# Altium schematic sheet fullCURRENT power logic.SchDoc: fullCURRENT 1.0
size C; Author: JNutzmann; CompanyName: FSE; DocumentNumber: 2
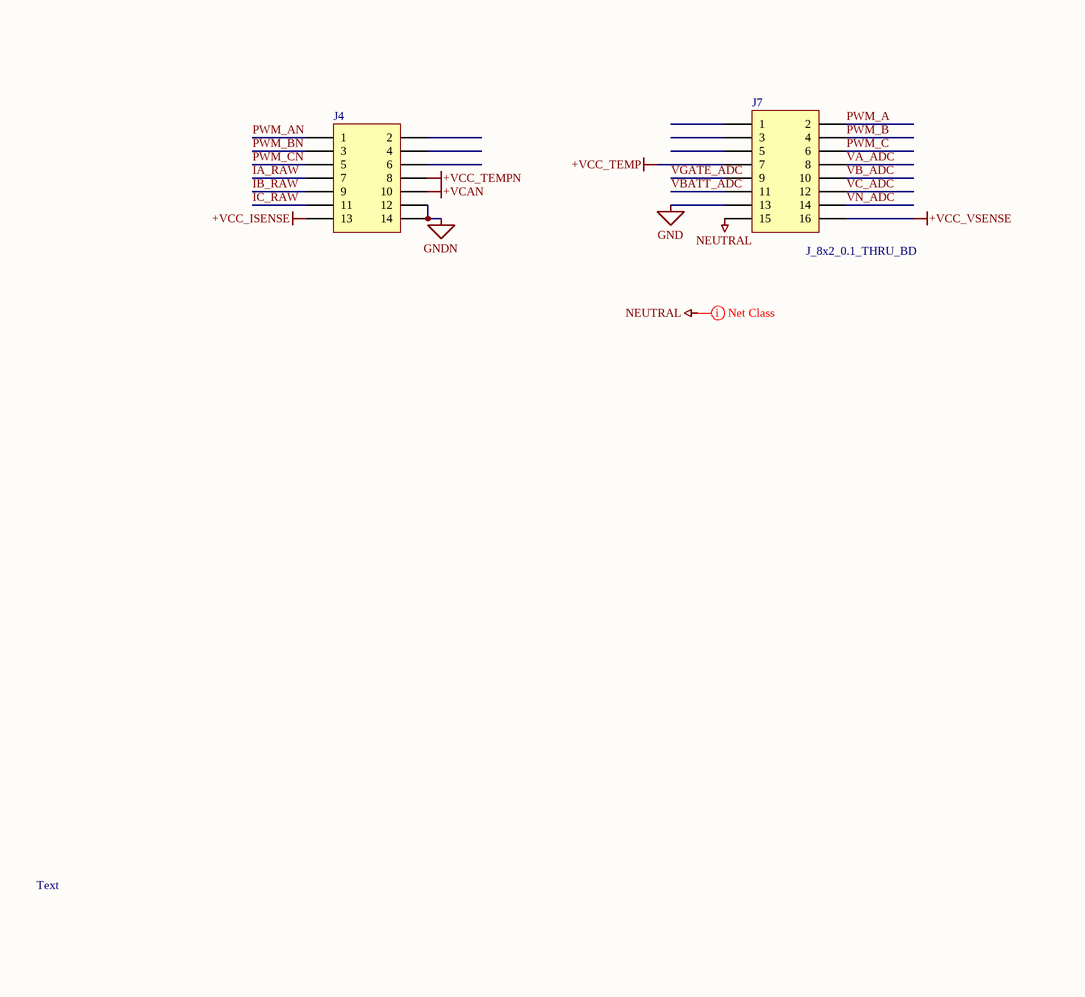
[diagram p0: fullCURRENT power logic.SchDoc, left]
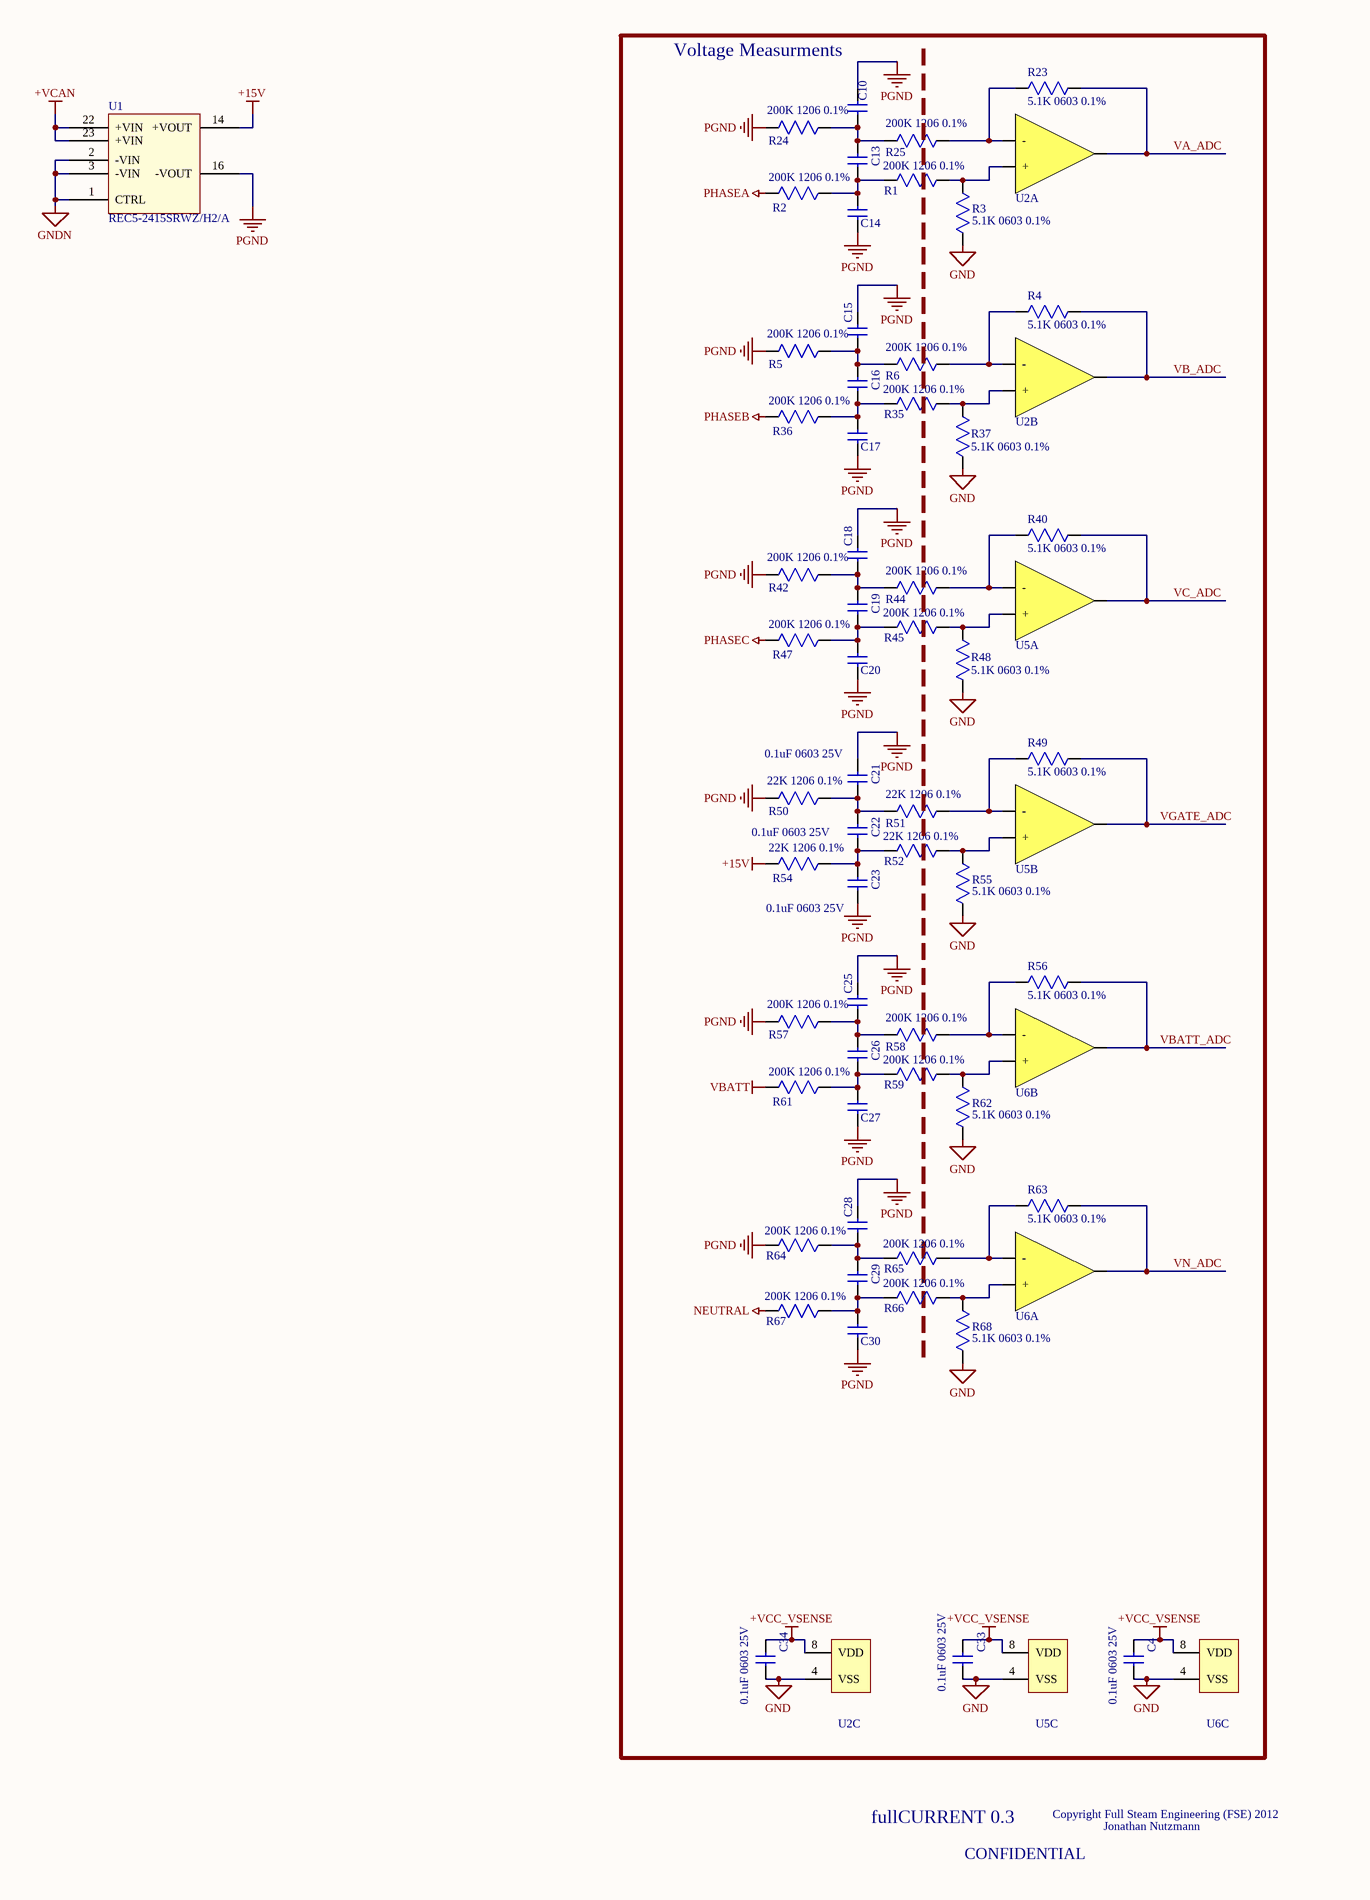
[diagram p1: fullCURRENT power logic.SchDoc, right]

## Parts
C4  value 0.1uF 0603 25V  [0603_cap]  (hidden comment: CAP 0603)
C10  CAP 0603  [0603_cap]  (value not drawn)
C13  CAP 0603  [0603_cap]  (value not drawn)
C14  CAP 0603  [0603_cap]  (value not drawn)
C15  CAP 0603  [0603_cap]  (value not drawn)
C16  CAP 0603  [0603_cap]  (value not drawn)
C17  CAP 0603  [0603_cap]  (value not drawn)
C18  CAP 0603  [0603_cap]  (value not drawn)
C19  CAP 0603  [0603_cap]  (value not drawn)
C20  CAP 0603  [0603_cap]  (value not drawn)
C21  value 0.1uF 0603 25V  [0603_cap]  (hidden comment: CAP 0603)
C22  value 0.1uF 0603 25V  [0603_cap]  (hidden comment: CAP 0603)
C23  value 0.1uF 0603 25V  [0603_cap]  (hidden comment: CAP 0603)
C25  CAP 0603  [0603_cap]  (value not drawn)
C26  CAP 0603  [0603_cap]  (value not drawn)
C27  CAP 0603  [0603_cap]  (value not drawn)
C28  CAP 0603  [0603_cap]  (value not drawn)
C29  CAP 0603  [0603_cap]  (value not drawn)
C30  CAP 0603  [0603_cap]  (value not drawn)
C33  value 0.1uF 0603 25V  [0603_cap]  (hidden comment: CAP 0603)
C34  value 0.1uF 0603 25V  [0603_cap]  (hidden comment: CAP 0603)
J4  J_7x2_0.1_THRU_BD  [ZW-07-10-X-D-500-085]  (value not drawn)
J7  J_8x2_0.1_THRU_BD  [ZW-08-10-X-D-500-085]
R1  value 200K 1206 0.1%  [1206_Resistor]  (hidden comment: RES 1206)
R2  value 200K 1206 0.1%  [1206_Resistor]  (hidden comment: RES 1206)
R3  value 5.1K 0603 0.1%  [0603_res]  (hidden comment: RES 0603)
R4  value 5.1K 0603 0.1%  [0603_res]  (hidden comment: RES 0603)
R5  value 200K 1206 0.1%  [1206_Resistor]  (hidden comment: RES 1206)
R6  value 200K 1206 0.1%  [1206_Resistor]  (hidden comment: RES 1206)
R23  value 5.1K 0603 0.1%  [0603_res]  (hidden comment: RES 0603)
R24  value 200K 1206 0.1%  [1206_Resistor]  (hidden comment: RES 1206)
R25  value 200K 1206 0.1%  [1206_Resistor]  (hidden comment: RES 1206)
R35  value 200K 1206 0.1%  [1206_Resistor]  (hidden comment: RES 1206)
R36  value 200K 1206 0.1%  [1206_Resistor]  (hidden comment: RES 1206)
R37  value 5.1K 0603 0.1%  [0603_res]  (hidden comment: RES 0603)
R40  value 5.1K 0603 0.1%  [0603_res]  (hidden comment: RES 0603)
R42  value 200K 1206 0.1%  [1206_Resistor]  (hidden comment: RES 1206)
R44  value 200K 1206 0.1%  [1206_Resistor]  (hidden comment: RES 1206)
R45  value 200K 1206 0.1%  [1206_Resistor]  (hidden comment: RES 1206)
R47  value 200K 1206 0.1%  [1206_Resistor]  (hidden comment: RES 1206)
R48  value 5.1K 0603 0.1%  [0603_res]  (hidden comment: RES 0603)
R49  value 5.1K 0603 0.1%  [0603_res]  (hidden comment: RES 0603)
R50  value 22K 1206 0.1%  [1206_Resistor]  (hidden comment: RES 1206)
R51  value 22K 1206 0.1%  [1206_Resistor]  (hidden comment: RES 1206)
R52  value 22K 1206 0.1%  [1206_Resistor]  (hidden comment: RES 1206)
R54  value 22K 1206 0.1%  [1206_Resistor]  (hidden comment: RES 1206)
R55  value 5.1K 0603 0.1%  [0603_res]  (hidden comment: RES 0603)
R56  value 5.1K 0603 0.1%  [0603_res]  (hidden comment: RES 0603)
R57  value 200K 1206 0.1%  [1206_Resistor]  (hidden comment: RES 1206)
R58  value 200K 1206 0.1%  [1206_Resistor]  (hidden comment: RES 1206)
R59  value 200K 1206 0.1%  [1206_Resistor]  (hidden comment: RES 1206)
R61  value 200K 1206 0.1%  [1206_Resistor]  (hidden comment: RES 1206)
R62  value 5.1K 0603 0.1%  [0603_res]  (hidden comment: RES 0603)
R63  value 5.1K 0603 0.1%  [0603_res]  (hidden comment: RES 0603)
R64  value 200K 1206 0.1%  [1206_Resistor]  (hidden comment: RES 1206)
R65  value 200K 1206 0.1%  [1206_Resistor]  (hidden comment: RES 1206)
R66  value 200K 1206 0.1%  [1206_Resistor]  (hidden comment: RES 1206)
R67  value 200K 1206 0.1%  [1206_Resistor]  (hidden comment: RES 1206)
R68  value 5.1K 0603 0.1%  [0603_res]  (hidden comment: RES 0603)
U1  U_REC5-2415SRWZ/H2/A  [REC5-2415SRWZ/H2/A]  (value not drawn)
U2  IC OP AMP  [SOIC127P600X175-8N]  (value not drawn)  (parts A,B,C of 3)
U5  IC OP AMP  [SOIC127P600X175-8N]  (value not drawn)  (parts A,B,C of 3)
U6  IC OP AMP  [SOIC127P600X175-8N]  (value not drawn)  (parts A,B,C of 3)

## Blocks framed on the sheet
Voltage Measurments: C4 C10 C13-C23 C25-C30 C33 C34 R1-R6 R23-R25 R35-R37 R40 R42 R44 R45 R47-R52 R54-R59 R61-R68 U2 U5 U6

## Nets
+15V: R54.2 U1.14(+VOUT)
+VCAN: J4.10 U1.22(+VIN) U1.23(+VIN)
+VCC_ISENSE: J4.13
+VCC_TEMP: J7.7
+VCC_TEMPN: J4.8
+VCC_VSENSE: C4.2 C33.2 C34.2 J7.16 U2.8(VDD) U5.8(VDD) U6.8(VDD)
GND: C4.1 C33.1 C34.1 J7.13 R3.1 R37.2 R48.1 R55.1 R62.1 R68.1 U2.4(VSS) U5.4(VSS) U6.4(VSS)
GNDN: J4.12 J4.14 U1.1(CTRL) U1.2(-VIN) U1.3(-VIN)
NEUTRAL: J7.15 R67.2
PGND: C10.2 C14.1 C15.2 C17.1 C18.2 C20.1 C21.2 C23.1 C25.2 C27.1 C28.2 C30.1 R5.2 R24.2 R42.2 R50.2 R57.2 R64.2 U1.16(-VOUT)
PHASEA: R2.2
PHASEB: R36.2
PHASEC: R47.2
VBATT: R61.2
IA_RAW: J4.7
IB_RAW: J4.9
IC_RAW: J4.11
PWM_A: J7.2
PWM_AN: J4.1
PWM_B: J7.4
PWM_BN: J4.3
PWM_C: J7.6
PWM_CN: J4.5
VA_ADC: J7.8 R23.2 U2.1(Vo)
VB_ADC: J7.10 R4.2 U2.7(Vo)
VBATT_ADC: J7.11 R56.1 U6.7(Vo)
VC_ADC: J7.12 R40.1 U5.1(Vo)
VGATE_ADC: J7.9 R49.1 U5.7(Vo)
VN_ADC: J7.14 R63.1 U6.1(Vo)
NetC10_1: C10.1 C13.2 R24.1 R25.2
NetC13_1: C13.1 C14.2 R1.2 R2.1
NetC15_1: C15.1 C16.2 R5.1 R6.2
NetC16_1: C16.1 C17.2 R35.2 R36.1
NetC18_1: C18.1 C19.2 R42.1 R44.2
NetC19_1: C19.1 C20.2 R45.2 R47.1
NetC21_1: C21.1 C22.2 R50.1 R51.2
NetC22_1: C22.1 C23.2 R52.2 R54.1
NetC25_1: C25.1 C26.2 R57.1 R58.2
NetC26_1: C26.1 C27.2 R59.2 R61.1
NetC28_1: C28.1 C29.2 R64.1 R65.2
NetC29_1: C29.1 C30.2 R66.2 R67.1
NetR1_1: R1.1 R3.2 U2.3(+)
NetR4_1: R4.1 R6.1 U2.6(-)
NetR23_1: R23.1 R25.1 U2.2(-)
NetR35_1: R35.1 R37.1 U2.5(+)
NetR40_2: R40.2 R44.1 U5.2(-)
NetR45_1: R45.1 R48.2 U5.3(+)
NetR49_2: R49.2 R51.1 U5.6(-)
NetR52_1: R52.1 R55.2 U5.5(+)
NetR56_2: R56.2 R58.1 U6.6(-)
NetR59_1: R59.1 R62.2 U6.5(+)
NetR63_2: R63.2 R65.1 U6.2(-)
NetR66_1: R66.1 R68.2 U6.3(+)

Not connected (* = marked no-connect by the designer): J4 2 4 6; J7 1 3 5

## Layout directives
net class HV: NEUTRAL

## Notes on the sheet
- Text
- fullCURRENT 0.3
- Copyright Full Steam Engineering (FSE) 2012
- Jonathan Nutzmann
- CONFIDENTIAL
- Labels drawn without touching a wire or pin: NEUTRAL

## Library data of the parts
C4 C21-C23 C33 C34 = C_0603: CAP CERM 0.1uF 0603 X7R; Supplier 1: Digi-Key; Supplier Part Number 1: 490-1524-1-ND
C10 C13-C20 C25-C30 = C_0603: CAP CERM 47PF 100V 0603 NP0; Supplier 1: Digi-Key; Supplier Part Number 1: 399-7917-1-ND
J4 = J_7x2_0.1_THRU_BD: 7 x 2 0.1" Header; Manufacturer Part Number: ZW-07-19-F-D-1000-085; Manufacturer: Samtec; Supplier 1: Samtec; Supplier Part Number 1: ZW-07-19-F-D-1000-085
J7 = J_8x2_0.1_THRU_BD: 8 x 2 0.1" Header; Manufacturer: Samtec; Manufacturer Part Number: ZW-08-10-X-D-500-085; Supplier 1: Samtec; Supplier Part Number 1: ZW-08-10-X-D-500-085
R1 R2 R5 R6 R24 R25 R35 R36 R42 R44 R45 R47 R57-R59 R61 R64-R67 = R_1206: RES 200K 1206 0.1%; Supplier 1: Digi-Key; Supplier Part Number 1: RG32P200KBCT-ND
R3 R4 R23 R37 R40 R48 R49 R55 R56 R62 R63 R68 = R_0603: RES 5.1K 0603 0.1%; Supplier 1: Digi-Key; Supplier Part Number 1: A103113CT-ND
R50-R52 R54 = R_1206: RES 22k 1206 0.1%; Supplier 1: Digi-Key; Supplier Part Number 1: RG32P22.0KBCT-ND
U1 = U_REC5-2415SRWZ/H2/A: CONV DC/DC 5W 9-36VIN 15VOUT; Manufacturer: Recomb Power; Number of Outputs: 1; Voltage - Input (Min): 9V; Voltage - Input (Max): 36V; Voltage - Output 1: 15V; Current - Output (Max): 340mA; Voltage - Isolation: 2kV (2000V); Efficiency: 85%; Part Number: REC5-2415SRWZ/H2/A; Supplier 1: Digi-Key; Supplier Part Number 1: 945-1486-5-ND; Manufacturer Part Number: REC5-2415SRWZ/H2/A; RoHS: RoHS Compliant; Category: Power Supplies - Board Mount; Stock 1: 15; Pricing 1: 1=21.27, 5=21.108, 10=20.944, 50=19.635, 100=17.9988, 250=17.67152 (USD); Type: Isolated; Voltage - Output 2: -; Voltage - Output 3: -; Power (Watts) - Manufacture Series: 5W; Features: SCP; Mounting Type: Through Hole; Package / Case: 24-DIP Module (8 Leads); Size / Dimension: 1.26" L x 0.80" W x 0.40" H (32.0mm x 20.3mm x 10.2mm); Packaging: Tube; Operating Temperature: -40°C ~ 75°C; Power (Watts) - Max: 5W; ComponentLink1URL: http://www.recom-power.com/pdf/Econoline/REC5-SRW_DRW_Z_Hx.pdf; ComponentLink1Description: http://www.recom-power.com/pdf/Econoline/REC5-SRW_DRW_Z_Hx.pdf
U2 U5 U6 = U_MCP6V02-E/SN: IC OPAMP AUTO-ZERO DUAL 8SOIC; Manufacturer: Microchip; Manufacturer PN: MCP6V02-E/SN; Supplier 1: Digi-Key; Supplier Part Number 1: MCP6V02-E/SN-ND